# EAGLE design housesensor (EAGLE 6.3)
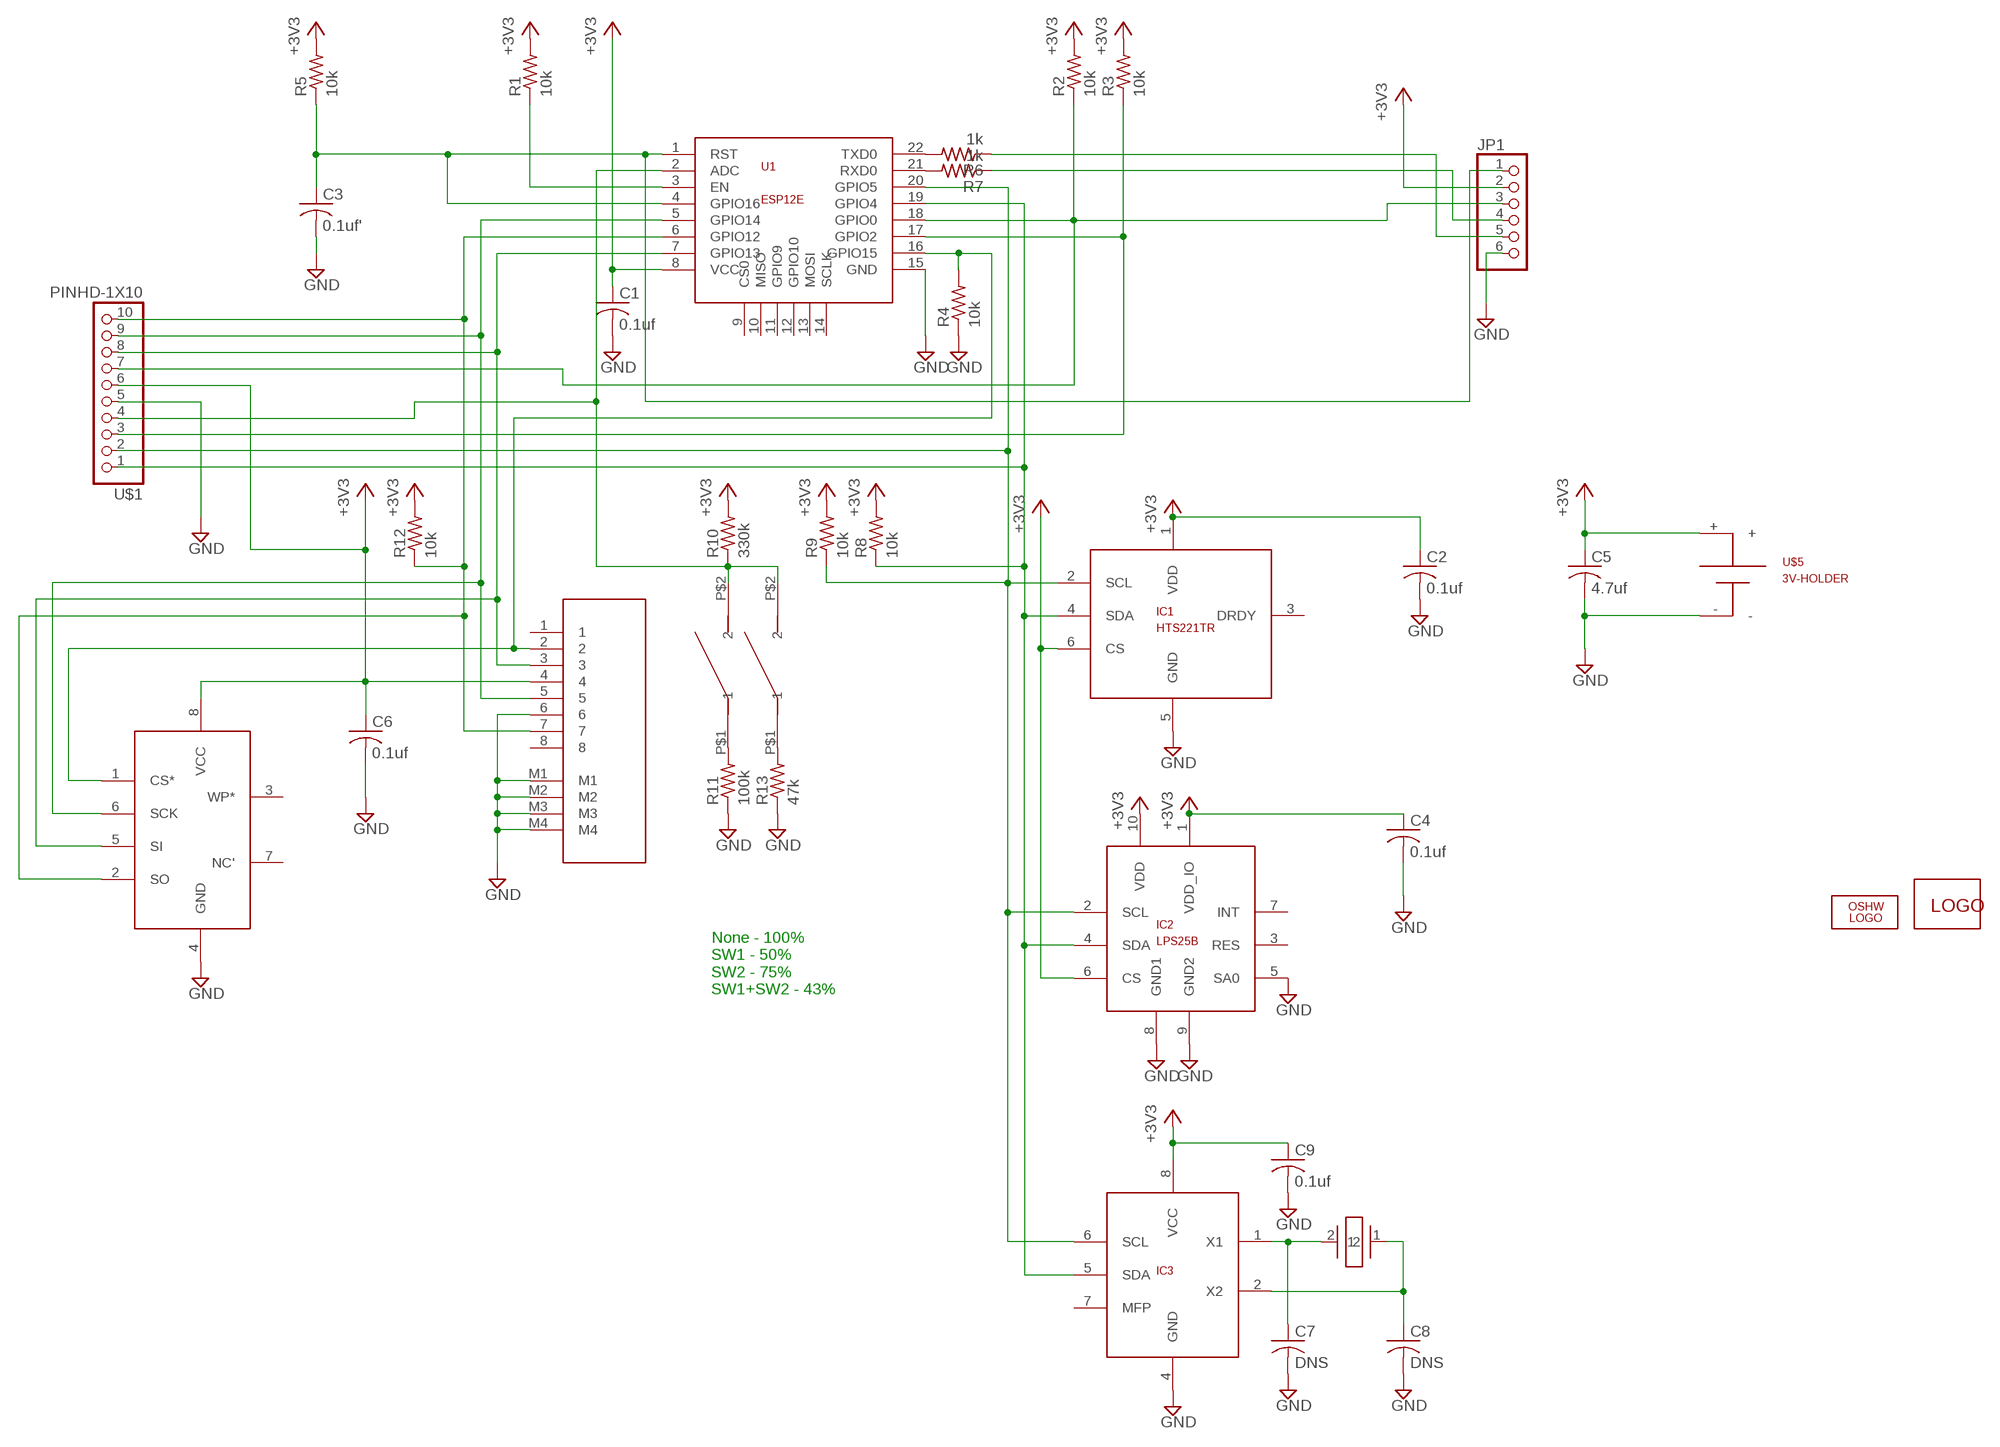
[diagram p0: schematic, sheet 1]

## Parts
C1  0.1uf  C-USC0603  [C0603]
C2  0.1uf  C-USC0603  [C0603]
C3  0.1uf'  C-USC0603  [C0603]
C4  0.1uf  C-USC0603  [C0603]
C5  4.7uf  C-USC1206  [C1206]
C6  0.1uf  C-USC0603  [C0603]
C7  DNS  C-USC0603  [C0603]
C8  DNS  C-USC0603  [C0603]
C9  0.1uf  C-USC0603  [C0603]
IC1  HTS221TR  [HTS221]
IC2  LPS25B  [LPS25]
IC3  MCP7940MS08M  [SO8M]
IC4  SPI-FLASH  [SO8J]
JP1  PINHD-1X6  [1X06]
LOGO1  OSHW_LOGO_FILLX0150-NT  [OSHW_FILLX150_NOTEXT]
R1  10k  R-US_R0603  [R0603]
R2  10k  R-US_R0603  [R0603]
R3  10k  R-US_R0603  [R0603]
R4  10k  R-US_R0603  [R0603]
R5  10k  R-US_R0603  [R0603]
R6  1k  R-US_R0603  [R0603]
R7  1k  R-US_R0603  [R0603]
R8  10k  R-US_R0603  [R0603]
R9  10k  R-US_R0603  [R0603]
R10  330k  R-US_R0603  [R0603]
R11  100k  R-US_R0603  [R0603]
R12  10k  R-US_R0603  [R0603]
R13  47k  R-US_R0603  [R0603]
SW1  RED-SWITCH  [SW2]
SW2  RED-SWITCH  [SW2]
U1  ESP12E  [ESP8266-SMD]
U$1  PINHD-1X10  [1X10-BIG]
U$4  MICRO-SD-SCHD1A0101  [MICROSD-P]
U$5  3V-HOLDER  [3V-HOLDER]
U$6  MOONBASE-LOGO  [MOONBASE-LOGO]
X1  32KHZ  [32KHZ]

## Nets
+3V3: C1.1 C2.1 C4.1 C5.1 C6.1 C9.1 IC1.1(VDD) IC1.6(CS) IC2.1(VDD_IO) IC2.6(CS) IC2.10(VDD) IC3.8(VCC) IC4.8(VCC) JP1.2 R1.2 R2.2 R3.2 R5.2 R8.2 R9.2 R10.2 R12.2 U1.8(VCC) U$1.6 U$4.4 U$5.+
EN: R1.1 U1.3(EN)
GND: C1.2 C2.2 C3.2 C4.2 C5.2 C6.2 C7.2 C8.2 C9.2 IC1.5(GND) IC2.5(SA0) IC2.8(GND1) IC2.9(GND2) IC3.4(GND) IC4.4(GND) JP1.6 R4.1 R11.1 R13.1 U1.15(GND) U$1.5 U$4.6 U$4.M1 U$4.M2 U$4.M3 U$4.M4 U$5.-
GPIO0: JP1.3 R2.1 U1.18(GPIO0) U$1.7
GPIO2: R3.1 U1.17(GPIO2) U$1.3
GPIO12: IC4.2(SO) R12.1 U1.6(GPIO12) U$1.10 U$4.7
GPIO13: IC4.5(SI) U1.7(GPIO13) U$1.8 U$4.3
GPIO14: IC4.6(SCK) U1.5(GPIO14) U$1.9 U$4.5
GPIO15: IC4.1(CS*) R4.2 U1.16(GPIO15) U$4.2
N$1: R11.2 SW1.P$1
N$2: R10.1 SW1.P$2 SW2.P$2 U1.2(ADC) U$1.4
N$3: R13.2 SW2.P$1
N$4: C8.1 IC3.2(X2) X1.1
N$5: C7.1 IC3.1(X1) X1.2
N$8: R6.2 U1.22(TXD0)
N$9: R7.2 U1.21(RXD0)
N$10: JP1.5 R6.1
N$11: JP1.4 R7.1
RST: C3.1 JP1.1 R5.1 U1.1(RST) U1.4(GPIO16)
SCL: IC1.2(SCL) IC2.2(SCL) IC3.6(SCL) R9.1 U1.20(GPIO5) U$1.2
SDA: IC1.4(SDA) IC2.4(SDA) IC3.5(SDA) R8.1 U1.19(GPIO4) U$1.1
Unconnected: IC1.3(DRDY) IC2.3(RES) IC2.7(INT) IC3.7(MFP) IC4.3(WP*) IC4.7(NC') U1.9(CS0) U1.10(MISO) U1.11(GPIO9) U1.12(GPIO10) U1.13(MOSI) U1.14(SCLK) U$4.1 U$4.8

## Notes on the sheet
- None - 100%
  SW1 - 50%
  SW2 - 75%
  SW1+SW2 - 43%

## Library data of the parts
C1-C9 = resistor:C-US: CAPACITOR, American symbol
IC1 = usb-serial:HTS221TR
IC2 = usb-serial:LPS25B
IC3 = usb-serial:MCP7940M
IC4 = usb-serial:SPI-FLASH
JP1 = adafruit:PINHD-1X6: PIN HEADER
LOGO1 = ohw-logo:OSHW_LOGO_FILL
R1-R13 = resistor:R-US_: RESISTOR, American symbol
SW1 SW2 = pibot:RED-SWITCH
U1 = pibot:ESP12E
U$1 = adafruit:PINHD-1X10: Pin header 1x10 0.1" spacing With round pins
U$4 = ATRF230:MICRO-SD-SCHD1A0101
U$5 = usb-serial:3V-HOLDER
U$6 = ll:MOONBASE-LOGO
X1 = usb-serial:32KHZ

## Board
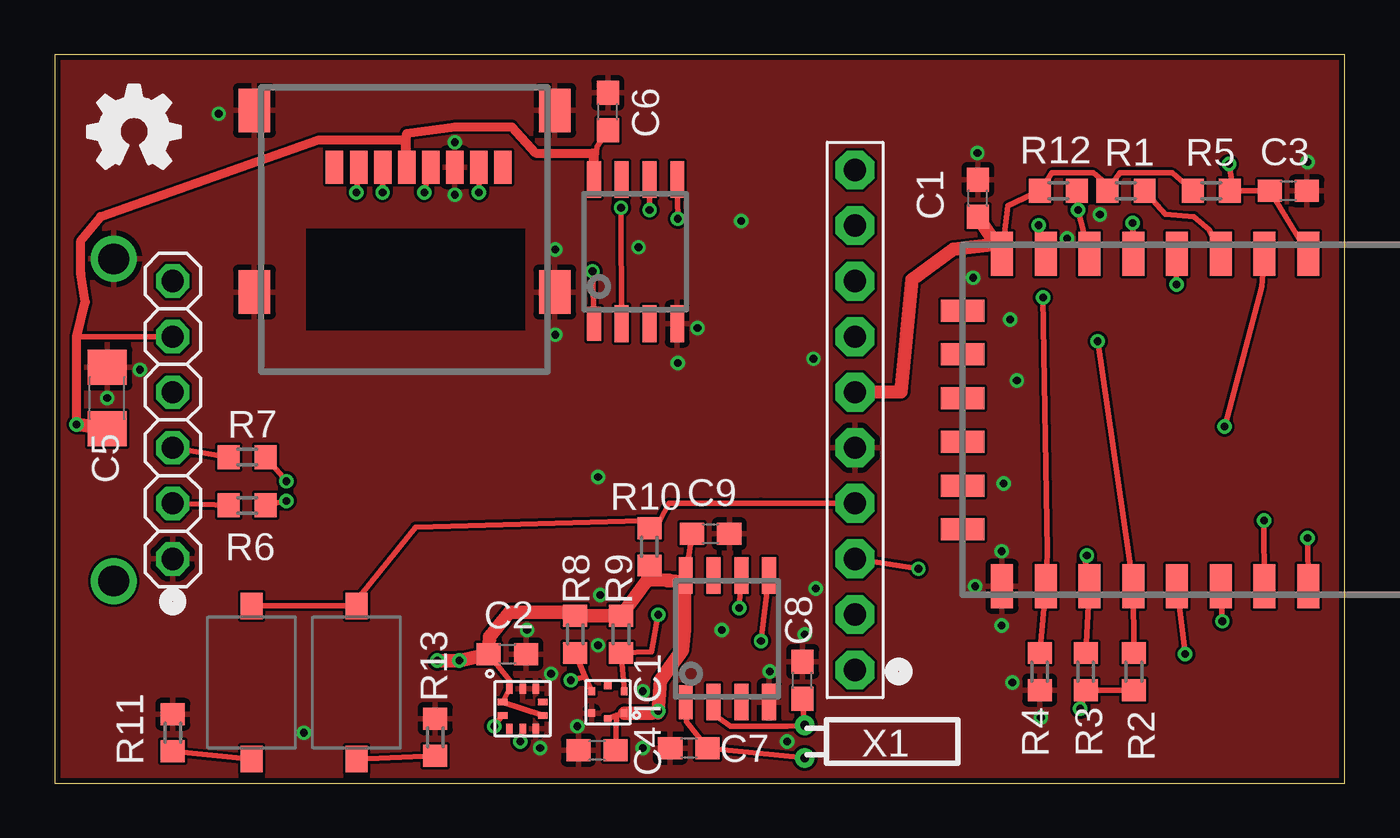
[diagram p1: board, top side]
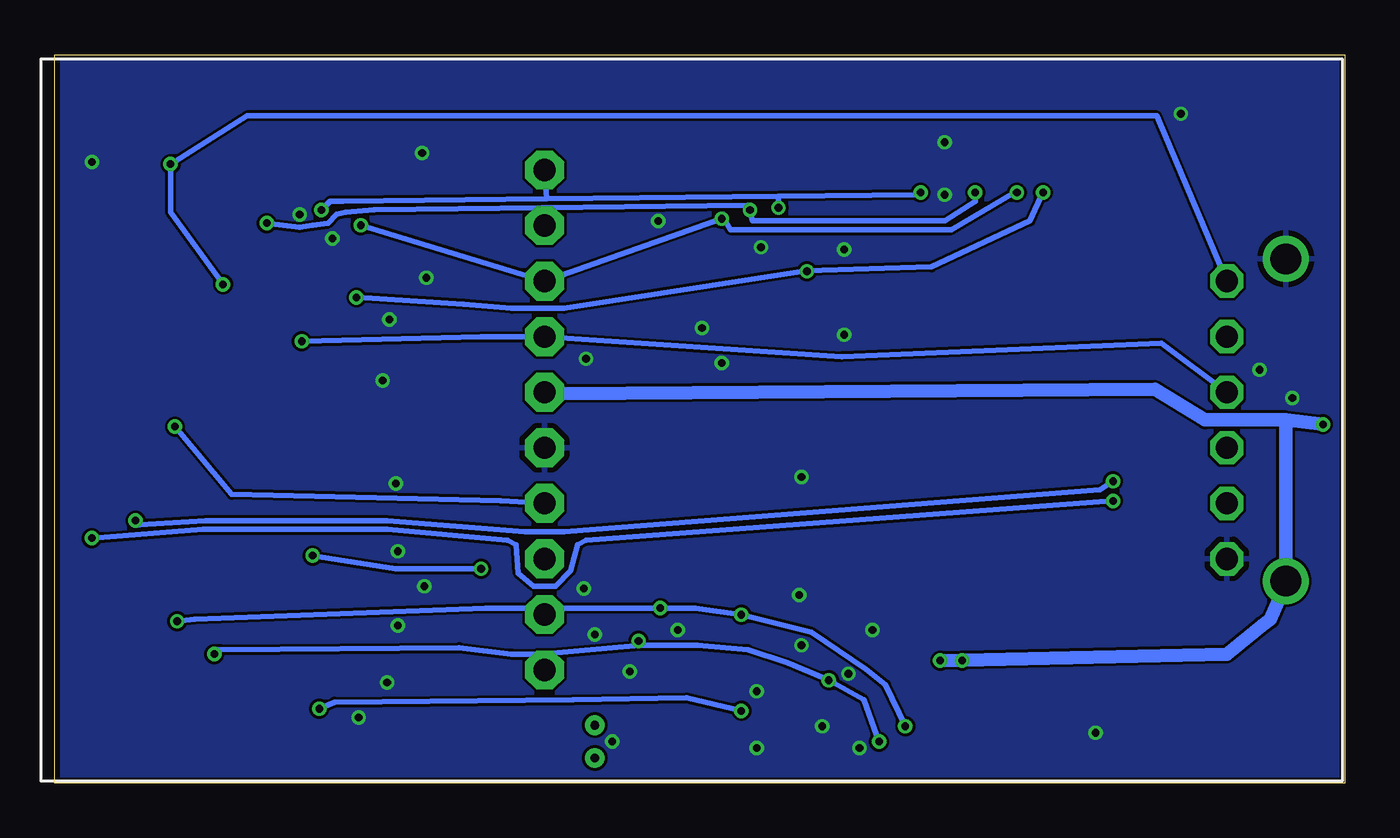
[diagram p2: board, bottom side, seen from below]

Size 59 x 33.3 mm. Coordinates in mm from the lower left corner, seen from the top.
Outline: 0,0 59,0 59,33.3 0,33.3 0,0
Copper layers (1*16): Top 0.035mm / dielectric 1.5mm / Bottom 0.035mm
Design rules "dirt_cheap_dirty_boards.v1": minimum track width 5mil, minimum drill 12mil, track to track 5mil, track to pad 5mil, pad to pad 5mil, via to via 5mil, smd to smd 0mil, copper to edge 10mil, drill to drill 10mil, minimum pad ring 10mil, minimum via ring 6mil, stop-mask expansion 2mil, vias tented up to drill 25mil, thermal gap 10mil

### Footprints (pad centres in the part's own frame; a part is rotated, then mirrored left to right if it is on the bottom)
C0603 = smd 1.1 x 1: 1 -0.85,0; 2 0.85,0
C1206 = smd 1.6 x 1.8: 1 -1.4,0; 2 1.4,0
HTS221 = smd 0.3 x 0.35: 1 -0.75,0.5; 2 -0.75,-0.5; 4 0.75,-0.5; 5 0.75,0.5 | smd 0.35 x 0.3: 3 0,-0.75; 6 0,0.75
LPS25 = smd 0.45 x 0.3: 1 -0.92,0.3; 2 -0.92,-0.3; 6 0.92,-0.3; 7 0.92,0.3 | smd 0.3 x 0.45: 3 -0.6,-0.92; 4 0,-0.92; 5 0.6,-0.92; 8 0.6,0.92; 9 0,0.92; 10 -0.6,0.92
SO8M = smd 1.57 x 0.635: 1 -2.9,2.54 | smd 1.67 x 0.635: 2 -2.9,1.27; 3 -2.9,0; 4 -2.9,-1.27; 5 2.9,-1.27; 6 2.9,0; 7 2.9,1.27; 8 2.9,2.54
SO8J = smd 1.57 x 0.635: 1 -3.3,2.54 | smd 1.67 x 0.635: 2 -3.3,1.27; 3 -3.3,0; 4 -3.3,-1.27; 5 3.3,-1.27; 6 3.3,0; 7 3.3,1.27; 8 3.3,2.54
1X06 = drill 1.016 octagon: 1 -6.35,0; 2 -3.81,0; 3 -1.27,0; 4 1.27,0; 5 3.81,0; 6 6.35,0
R0603 = smd 1 x 1.1: 1 -0.85,0; 2 0.85,0
SW2 = smd 1 x 1.2: P$1 0,3.5; P$2 0,-3.5
ESP8266-SMD = smd 2 x 1: 1 -7.6,14; 2 -7.6,12; 3 -7.6,10; 4 -7.6,8; 5 -7.6,6; 6 -7.6,4; 7 -7.6,2; 8 -7.6,0; 15 7.6,0; 16 7.6,2; 17 7.6,4; 18 7.6,6; 19 7.6,8; 20 7.6,10; 21 7.6,12; 22 7.6,14 | smd 1 x 2: 9 -5,-1.8; 10 -3,-1.8; 11 -1,-1.8; 12 1,-1.8; 13 3,-1.8; 14 5,-1.8
1X10-BIG = drill 1.016 pad 1.778 octagon: 1 -11.43,0; 2 -8.89,0; 3 -6.35,0; 4 -3.81,0; 5 -1.27,0; 6 1.27,0; 7 3.81,0; 8 6.35,0; 9 8.89,0; 10 11.43,0
MICROSD-P = smd 0.8 x 1.5: 1 3.2,-9.35; 2 2.1,-9.35; 3 1,-9.35; 4 -0.1,-9.35; 5 -1.2,-9.35; 6 -2.3,-9.35; 7 -3.4,-9.35; 8 -4.5,-9.35 | smd 1.45 x 2: M1 6.87,-3.65; M2 -6.87,-3.65; M3 -6.87,-11.95; M4 6.87,-11.95
3V-HOLDER = drill 1.4: + 7.366,0; - -7.366,0
32KHZ = drill 0.4: 1 -0.75,0; 2 0.75,0

### Placement (x,y rotation side)
C1  42.22,26.74 90 top
C2  20.7,5.9 0 top
C3  56.41,27.08 0 top
C4  24.8,1.5 180 top
C5  2.4,17.6 90 top
C6  25.3,30.7 90 top
C7  29,1.6 180 top
C8  34.2,4.7 90 top
C9  30,11.4 0 top
IC1  25.3,3.7 180 top
IC2  21.4,3.4 0 top
IC3  31.4,6.6 90 top
IC4  27.2,24.3 90 top
JP1  5.4,16.6 270 top
LOGO1  1.5,28.1 0 top
R1  48.99,27.08 180 top
R2  49.35,5.1 270 top
R3  47.15,5.1 270 top
R4  45.05,5.1 90 top
R5  52.89,27.08 180 top
R6  8.8,12.7 0 top
R7  8.8,14.9 0 top
R8  23.8,6.8 90 top
R9  25.9,6.8 90 top
R10  27.2,10.8 270 top
R11  5.4,2.3 270 top
R12  45.9,27.08 180 top
R13  17.4,2.1 270 top
SW1  9,4.6 180 top
SW2  13.8,4.6 180 top
U1  43.32,16.6 270 top
U$1  36.6,16.6 90 top
U$4  16,18.8 180 top
U$5  2.7,16.6 270 bottom
U$6  29.5,25.7 270 top
X1  34.3,1.9 270 top

### Tracks (layer width: path | path; a pad name or v marks a point on that pad's centre or on a via)
+3V3  (via drill 0.35)
  Top 0.254: IC2.6 IC2.1 IC2.10 20.8,4.7 C2.1 | R2.2 R3.2 v46.9,3.4 | R5.2 51.1,27.9 48.7,27.9 R1.2 48,27.5 47.5,27.9 45.6,27.9 45.1,27.1 | 45.1,27.1 43.6,26.4 U1.8 | 28.09,9.28 28.03,9.26 | R8.2 23.7,7.8 | C4.1 25.7,3.1 | IC1.6 25.7,3.1 | 27.3,3.2 27.59,3.21 v27.6,3.3 | 25.7,3.1 IC1.1 | JP1.2 3,20.4 1,20.4 | 45.1,27.1 R12.2 | IC4.8 24.8,29.1 C6.1 | R10.2 27.39,9.29 | 28.8,9.2 IC3.8 C9.1
  Top 0.406: v1,16.4 1,20.4 1.4,22 1.2,23.3 1.2,24.8 2.1,25.9 12.1,29.4 16,29.4 U$4.4 16.1,29.7 18.3,30 20.9,30 22,28.8 24.6,28.8 IC4.8
  Top 0.61: C1.1 43.04,24.63 | 43.04,24.63 U1.8 | R8.2 R9.2 27.1,9.3 27.39,9.29 28.09,9.28 | 23.7,7.8 20.8,7.8 19.9,6.7 C2.1 v18.5,5.6 v17.5,5.6 | IC1.1 27.3,3.2 | 27.59,3.21 27.7,4.7 28.7,6.1 28.8,7 28.8,9.2 28.03,9.26 | C5.1 v1,16.4 | U$1.6 38.7,17.9 39.2,23 41.1,24.4 43.04,24.63
  Bottom 0.254: v46.9,3.4 46.2,3.7 35.3,3.8 30.1,3.9 v27.6,3.3 | 35.9,17.8 U$1.6
  Bottom 0.406: 3.3,7.7 3.4,7.49
  Bottom 0.61: 2.7,16.6 6.4,16.6 8.7,18 35.9,17.8 | v18.5,5.6 12.51,5.74 5.4,5.9 3.8,7.2 3.4,7.49 2.8,8.9 U$5.+ 2.7,16.6 | 2.7,16.6 v1,16.4
EN
  Top 0.254: R1.1 50.8,26 52.1,25.9 52.8,25.3 U1.3
GND  (via drill 0.35)
  other vias: 43.3,10.6 21.6,7 22.7,5 23.9,2.6 42.1,9 26.9,4.2 11.4,2.3 7.5,30.6 22.9,24.4 28.5,19.2 18.3,26.9 18.3,29.3 42.2,28.8 57.3,28.4 45.1,3 22.2,1.6 42,23.1 43.4,13.7 24.85,6.3 43.7,21.2 34.7,19.4 44,18.4 24.95,8.6 24.85,14 31.4,25.7 43.8,4.6 3.9,18.9 2.4,17.6 46.3,24.9 47.8,26 22.9,20.5 26.7,24.5 43.3,7.2 29.4,20.8 34.8,8.9 30.5,7 32.7,5.1 33.5,1.9 26.9,1.6 34.3,6.8
  pour Bottom: 0,0 0,33.3 59,33.3 59,0
  pour Top: 0,0 0,33.3 59,33.3 59,0
GPIO0  (via drill 0.35)
  Top 0.254: R2.1 U1.18 v47.7,20.2
  Bottom 0.254: JP1.3 8.4,20.1 23,19.5 U$1.7 39.5,20.4 v47.7,20.2
GPIO2  (via drill 0.35)
  Top 0.254: R3.1 U1.17 47.1,10.3 v47.2,10.4 | v39.5,9.8 U$1.3
  Bottom 0.254: v47.2,10.4 43.4,9.8 v39.5,9.8
GPIO12  (via drill 0.35)
  Top 0.254: U$4.7 v19.4,27 | U1.6 v46.8,26.2 R12.1 | IC4.2 v25.9,26.3
  Bottom 0.254: v19.4,27 19.5,26.9 25.89,26.83 | 25.89,26.83 36.49,26.71 | 36.49,26.71 45.8,26.6 46.4,26.6 v46.8,26.2 | v25.9,26.3 25.89,26.83 | U$1.10 36.49,26.71
GPIO13  (via drill 0.35)
  Top 0.254: U1.7 v45,25.5 | v15,27 U$4.3 | IC4.5 v28.5,25.8
  Bottom 0.254: 28.41,26 28.4,25.8 | 28.4,25.8 28.1,25.3 18,25.3 15.1,27 15,27.1 v15,27 | v45,25.5 U$1.8 v28.5,25.8 28.4,25.8
GPIO14  (via drill 0.35)
  Top 0.254: U1.5 v49.3,25.6 | v16.9,27 U$4.5 | IC4.6 v27.2,26.2
  Bottom 0.254: v49.3,25.6 47.8,25.4 47.2,25.5 46.5,25.6 46.1,26 45.7,26.1 44.4,26.2 36.71,26.29 | 36.71,26.29 27.3,26.41 | 27.3,26.41 27.1,25.7 18.3,25.7 16.9,26.6 v16.9,27 | v27.2,26.2 27.3,26.41 | U$1.9 36.71,26.29
GPIO15  (via drill 0.35)
  Top 0.254: U$4.2 v13.8,27 | v45.2,22.2 45.4,10.6 45.4,10.5 U1.16 R4.2 | IC4.1 v24.6,23.4
  Bottom 0.254: 24.62,23.41 18.9,23.6 14.4,25.7 v13.8,27 | 24.62,23.41 35.7,21.7 38.1,21.7 40.3,21.9 v45.2,22.2 | v24.6,23.4 24.62,23.41
N$1
  Top 0.254: R11.2 SW1.P$1
N$2  (via drill 0.35)
  Top 0.254: 13.6,8.1 SW1.P$2 | v53.5,16.3 55.2,22.7 U1.2 | 27.68,12.02 16.5,11.7 13.6,8.1 | SW2.P$2 13.6,8.1 | R10.1 27.68,12.02 | 27.68,12.02 28.1,12.8 32.3,12.8 U$1.4
  Bottom 0.254: v53.5,16.3 50.9,13.2 38.6,12.9 U$1.4
N$3
  Top 0.254: SW2.P$1 R13.2
N$4
  Top 0.254: IC3.2 30.2,3.1 30.9,2.6 33.5,2.6 X1.1 C8.1
N$5
  Top 0.254: X1.2 C7.1 28.9,2.8 28.9,3.3 IC3.1
N$8  (via drill 0.35)
  Top 0.254: U1.22 v57.3,11.2 | v10.6,12.9 R6.2
  Bottom 0.254: v57.3,11.2 52.2,11.6 43.8,11.6 38.3,11.1 37.9,10.9 37.8,9.6 37.1,9 36.1,9 35.4,9.7 35.1,10.9 34.7,11.1 v10.6,12.9
N$9  (via drill 0.35)
  Top 0.254: R7.2 v10.6,13.8 | v55.3,12 U1.21
  Bottom 0.254: v10.6,13.8 11.2,13.4 35.7,11.5 37.5,11.5 43.8,12 52.1,12 55.1,11.8 v55.3,12
N$10
  Top 0.254: JP1.5 R6.1
N$11
  Top 0.254: JP1.4 R7.1
RST  (via drill 0.35)
  Top 0.254: v53.7,28.3 54,26.7 R5.1 C3.1 U1.1 | U1.4 v51.3,22.8
  Bottom 0.254: JP1.1 8.6,30.5 50.2,30.5 v53.7,28.3 53.7,26.1 v51.3,22.8
SCL  (via drill 0.35)
  Top 0.254: IC1.2 R9.1 27.3,6 v27.6,7.7 | IC2.2 v20.1,2.6 | v53.4,7.4 U1.20 | IC3.6 v31.3,8
  Bottom 0.254: v20.1,2.6 21,4.5 21.9,5.2 24.4,6.9 v27.6,7.7 29.7,8 v31.3,8 31.5,8 36.7,8 | 36.7,8 39.3,8 52.6,7.5 v53.4,7.4 | U$1.2 36.7,8
SDA  (via drill 0.35)
  Top 0.254: R8.1 24.25,4.87 | 24.25,4.87 IC1.4 | IC2.4 v21.3,1.9 | v23.6,4.7 24.25,4.87 | U1.19 v51.7,5.9 | IC3.5 v32.3,6.5
  Bottom 0.254: v21.3,1.9 22,3.8 v23.6,4.7 23.8,4.8 25.5,5.5 27.3,6.1 29.6,6.3 32.2,6.3 | v51.7,5.9 51.6,6.1 51.4,6.1 40.5,6.2 38.1,5.9 36.8,5.9 | 36.8,5.9 32.2,6.3 | U$1.1 36.8,5.9 | v32.3,6.5 32.2,6.3

### Text on the board
tDocu: Home Sensor | VCW | (C) 2016 / Paul Campbell | V1.0